# EAGLE design shield (EAGLE 7.7.0)
DRAWING_NUMBER: V001; DRAWN: Mario Blunk / Blunk electronic; PROJECT: agile HW demo; STATUS: development

## Sheet 1 of 4: connector core
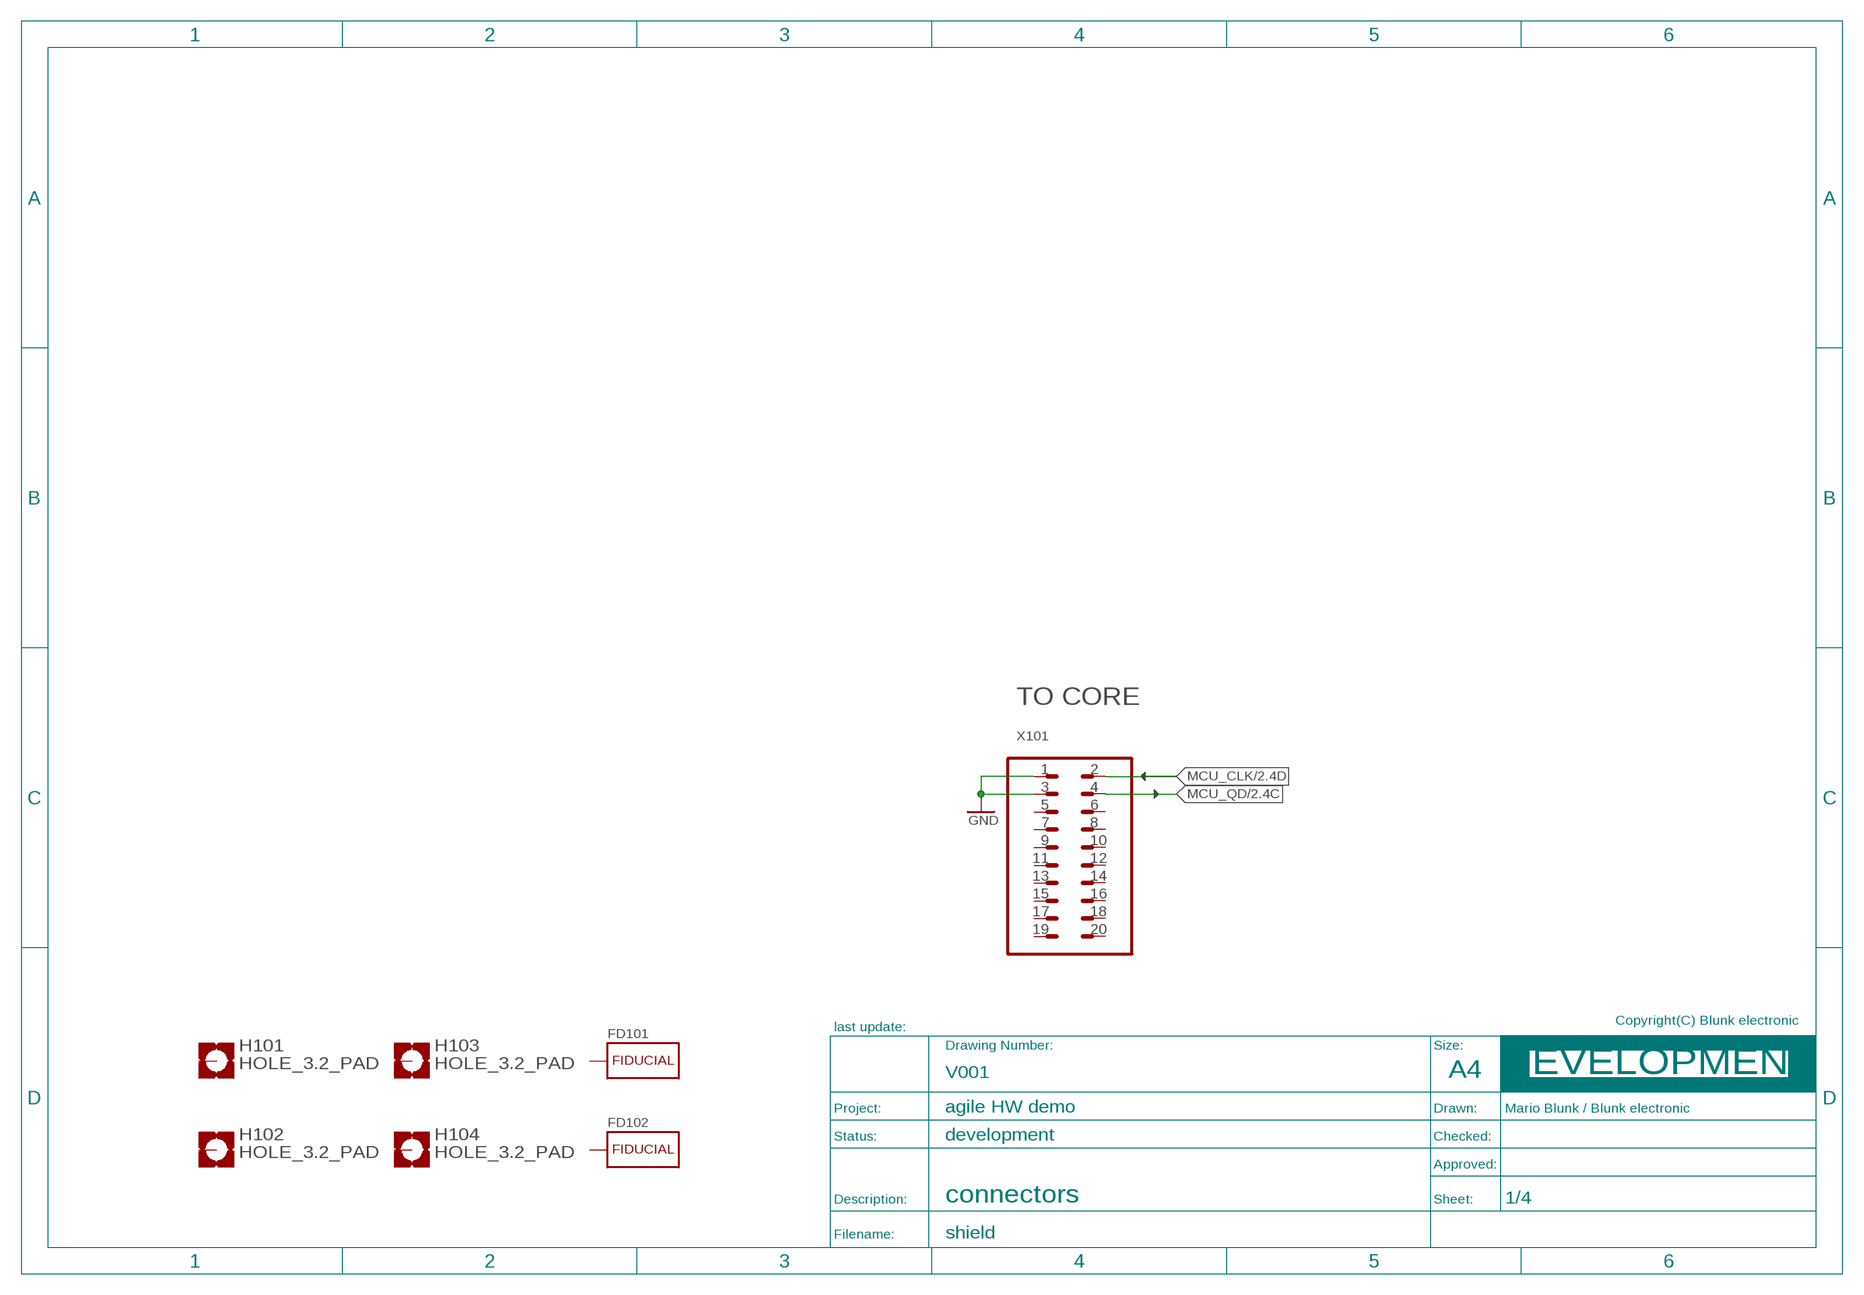
[diagram p0: schematic, sheet 1]
FRAME_DEVELOPMENT1 (A4_LANDSCAPE_DEVELOPMENT): BOM: NO; COMMISSIONED: 2013-08-30; DESCRIPTION: connectors
U$10 (ARROW_1): BOM: NO; COMMISSIONED: 2013-08-30
U$11 (ARROW_1): BOM: NO; COMMISSIONED: 2013-08-30

### Parts
FD101  FIDUCIAL_CROSSHAIR  [CROSSHAIR]
FD102  FIDUCIAL_CROSSHAIR  [CROSSHAIR]
H101  HOLE_3.2_PAD  [3.2_PAD]
H102  HOLE_3.2_PAD  [3.2_PAD]
H103  HOLE_3.2_PAD  [3.2_PAD]
H104  HOLE_3.2_PAD  [3.2_PAD]
X101  MALE_2X10-T-VERTICAL_2.54MM  [T_MALE_2X10_VERTICAL_GRID_2.54MM]

### Nets
GND: X101.1 X101.3 ; also sheet 3,4
MCU_CLK: X101.2 ; also sheet 2
MCU_QD: X101.4 ; also sheet 2
Unconnected: FD101.1(NC) FD102.1(NC) H101.H1(MOUNT) H102.H1(MOUNT) H103.H1(MOUNT) H104.H1(MOUNT) X101.5 X101.6 X101.7 X101.8 X101.9 X101.10 X101.11 X101.12 X101.13 X101.14 X101.15 X101.16 X101.17 X101.18 X101.19 X101.20

## Sheet 2 of 4: routing
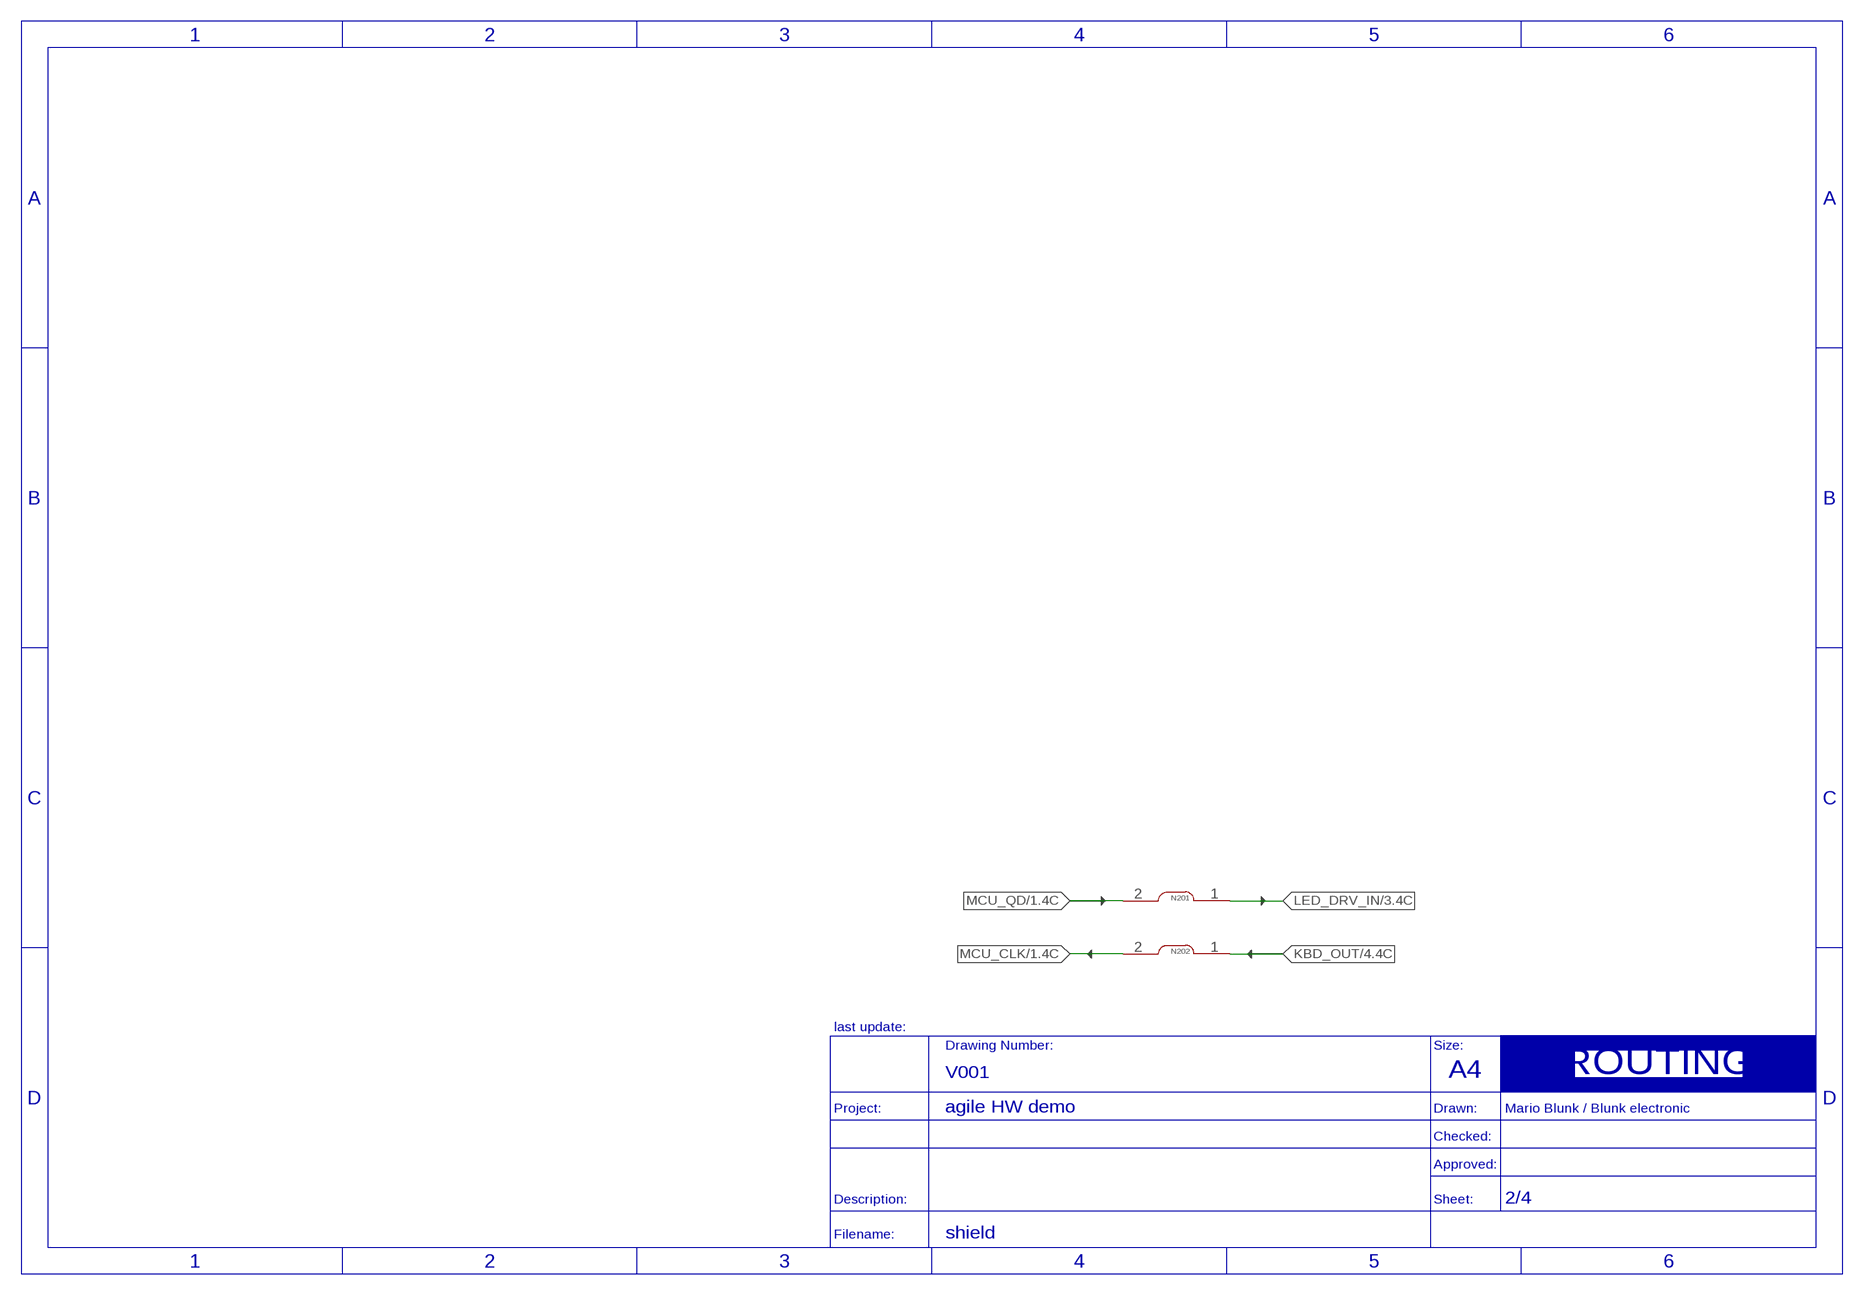
[diagram p1: schematic, sheet 2]
FRAME_NET_CHANGERS1 (A4_LANDSCAPE_NET_CHANGERS): BOM: NO; COMMISSIONED: 2013-08-30
U$2 (ARROW_1): BOM: NO; COMMISSIONED: 2013-08-30
U$3 (ARROW_1): BOM: NO; COMMISSIONED: 2013-08-30
U$4 (ARROW_1): BOM: NO; COMMISSIONED: 2013-08-30
U$5 (ARROW_1): BOM: NO; COMMISSIONED: 2013-08-30

### Parts
N201  NET_CHANGER-S-0.3MM  [S_NET_CHANGER_0.3MM]
N202  NET_CHANGER-S-0.15MM  [S_NET_CHANGER_0.15MM]

### Nets
KBD_OUT: N202.1 ; also sheet 4
LED_DRV_IN: N201.1 ; also sheet 3
MCU_CLK: N202.2 ; also sheet 1
MCU_QD: N201.2 ; also sheet 1

## Sheet 3 of 4: connector LED driver module
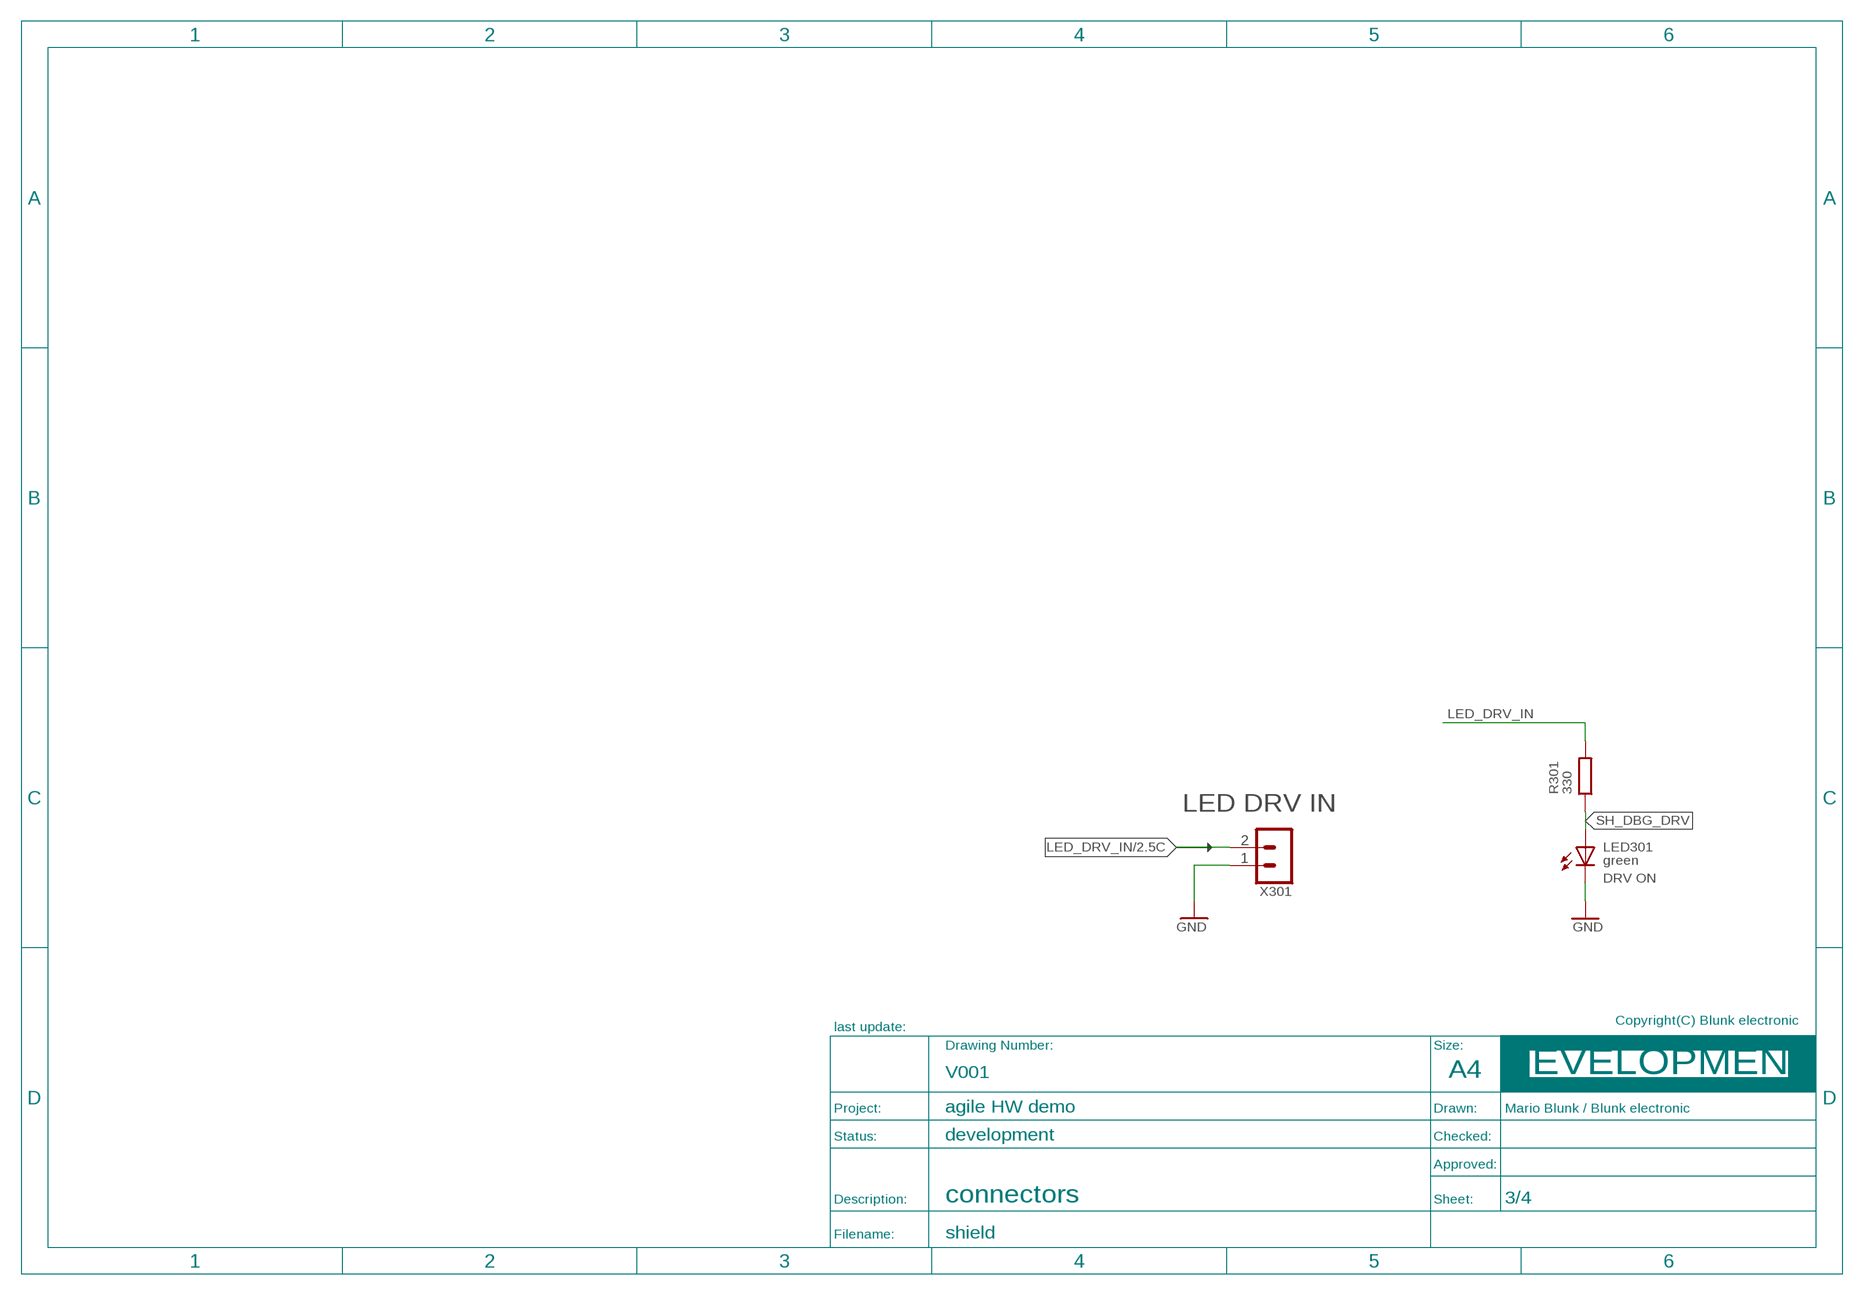
[diagram p2: schematic, sheet 3]
FRAME_DEVELOPMENT2 (A4_LANDSCAPE_DEVELOPMENT): BOM: NO; COMMISSIONED: 2013-08-30; DESCRIPTION: connectors
U$1 (ARROW_1): BOM: NO; COMMISSIONED: 2013-08-30

### Parts
LED301  green  LED_S_0805  [S_0805]
R301  330  R_S_0805  [S_0805]
X301  MALE_2X1-T-VERTICAL  [T_MALE_2X1_VERTICAL_PITCH_2MM54]

### Nets
GND: LED301.C X301.1 ; also sheet 1,4
LED_DRV_IN: R301.2 X301.2 ; also sheet 2
SH_DBG_DRV: LED301.A R301.1

## Sheet 4 of 4: connector keyboard module
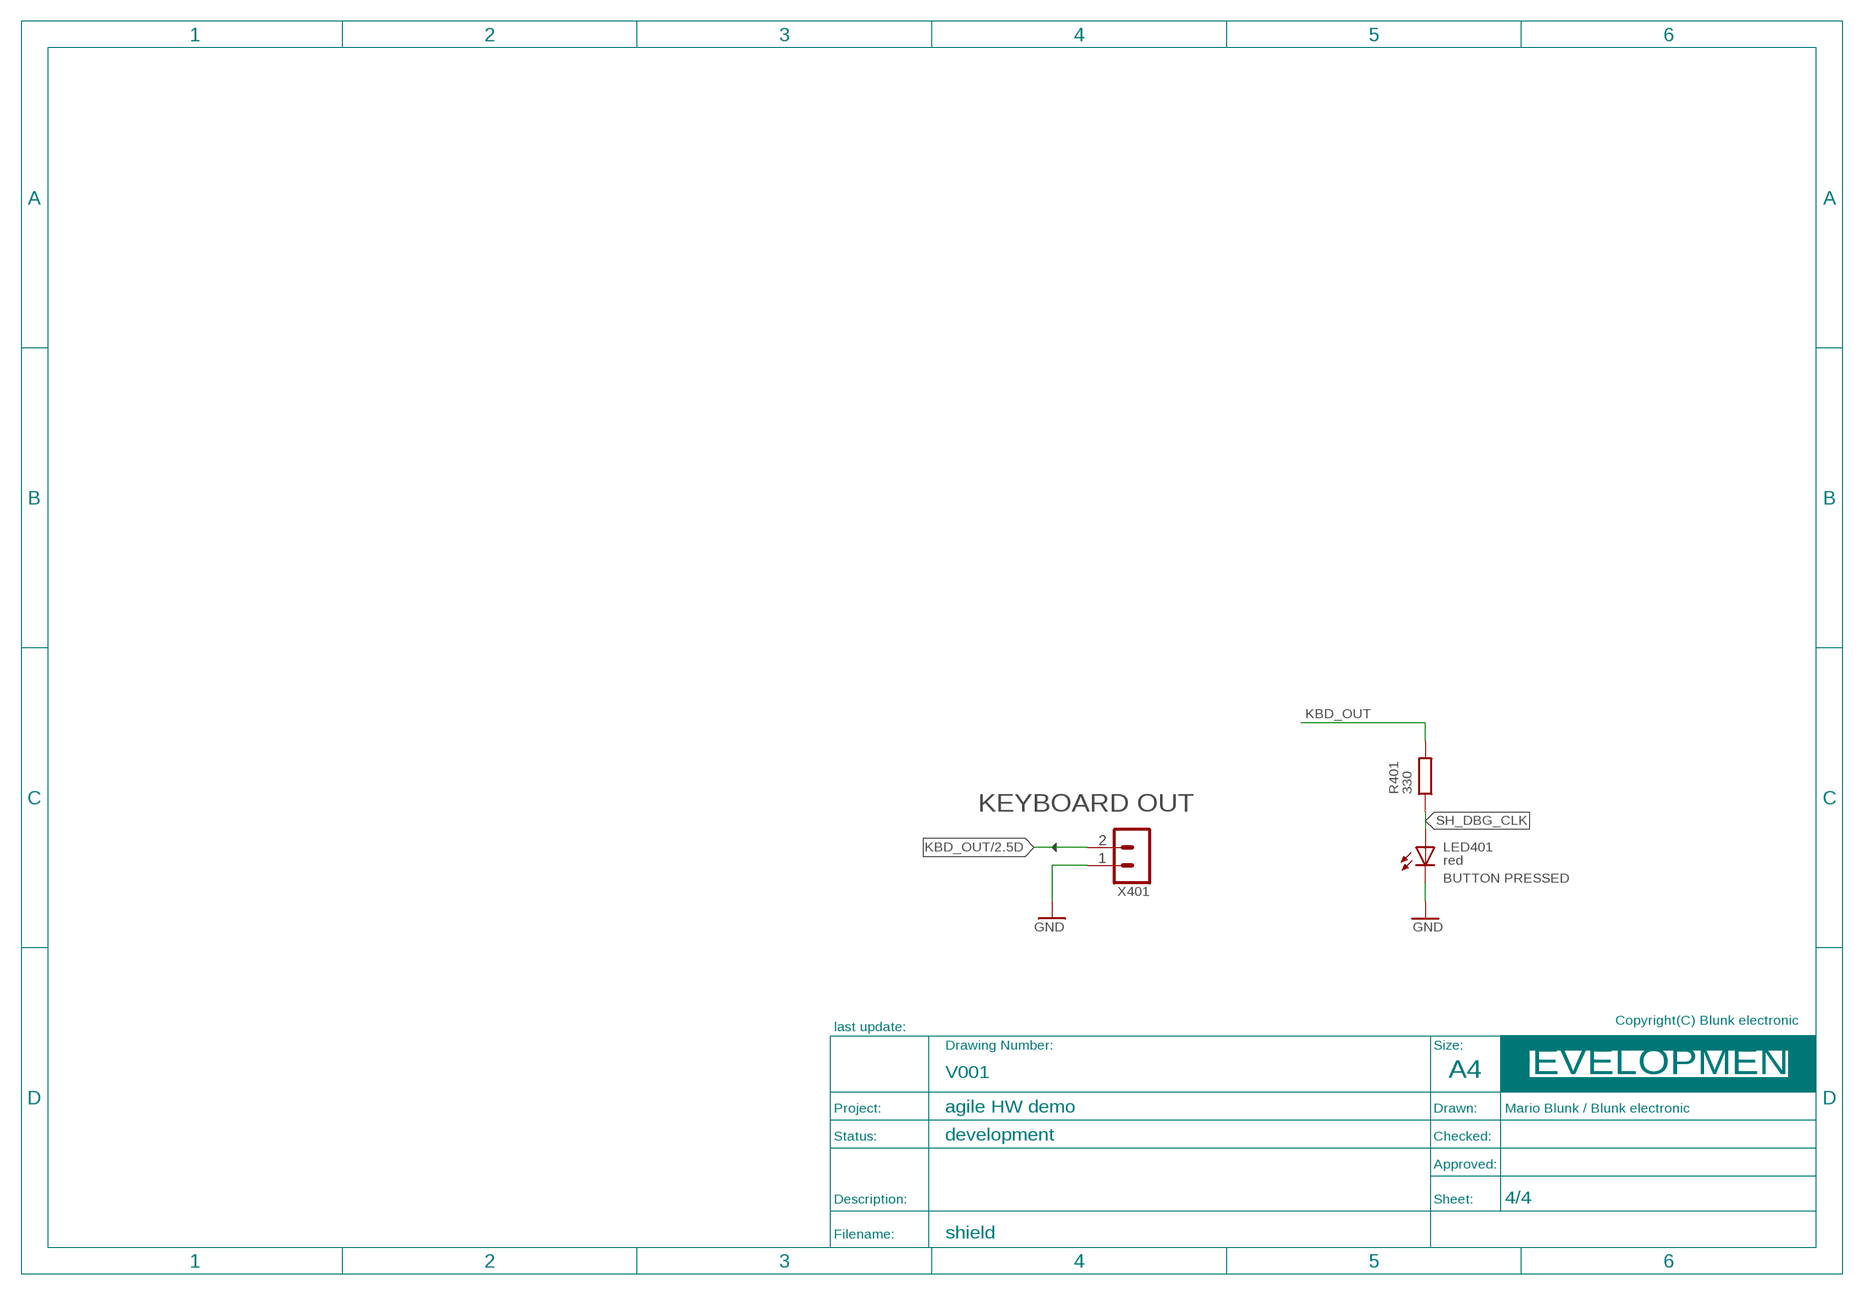
[diagram p3: schematic, sheet 4]
FRAME_DEVELOPMENT3 (A4_LANDSCAPE_DEVELOPMENT): BOM: NO; COMMISSIONED: 2013-08-30
U$6 (ARROW_1): BOM: NO; COMMISSIONED: 2013-08-30

### Parts
LED401  red  LED_S_0805  [S_0805]
R401  330  R_S_0805  [S_0805]
X401  MALE_2X1-T-VERTICAL  [T_MALE_2X1_VERTICAL_PITCH_2MM54]

### Nets
GND: LED401.C X401.1 ; also sheet 1,3
KBD_OUT: R401.2 X401.2 ; also sheet 2
SH_DBG_CLK: LED401.A R401.1

## Library data of the parts
FD101 FD102 = be_marks:FIDUCIAL: drawn: Mario Blunk / Blunk electronic; BOM: NO; COMMISSIONED: 2013-12-03
H101-H104 = be_holes:HOLE: edited: Mario Blunk; BOM: NO; COMMISSIONED: 2015-01-15
LED301 = be_opt:LED: single LED device drawn: Mario Blunk / Blunk electronic; BOM: YES; COMMISSIONED: 2013-08-30; FUNCTION: DRV ON; PART_CODE_BEL: LED_PAC_S_0805_VAL_green
LED401 = be_opt:LED: single LED device drawn: Mario Blunk / Blunk electronic; BOM: YES; COMMISSIONED: 2013-08-30; FUNCTION: BUTTON PRESSED; PART_CODE_BEL: LED_PAC_S_0805_VAL_red
N201 = be_con_jump:NET_CHANGER: drawn: Mario Blunk / Blunk electronic; BOM: NO; COMMISSIONED: 2014-04-09; PART_CODE_BEL: N_PAC_S_NET_CHANGER_0.3MM
N202 = be_con_jump:NET_CHANGER: drawn: Mario Blunk / Blunk electronic; BOM: NO; COMMISSIONED: 2013-08-30; PART_CODE_BEL: N_PAC_S_NET_CHANGER_0.15MM
R301 R401 = be_rcl:R: edited: Mario Blunk / Blunk electronic; BOM: YES; COMMISSIONED: 2013-08-30; PART_CODE_BEL: R_PAC_S_0805_VAL_330
X101 = be_con_jump:MALE_2X10: drawn: Mario Blunk / Blunk electronic; BOM: YES; COMMISSIONED: 2013-08-30; FUNCTION: TO CORE; PART_CODE_BEL: X_PAC_T_MALE_2X10_VERTICAL_PITCH_2mm54
X301 = be_con_jump:MALE_2X1: edited: Mario Blunk / Blunk electronic; BOM: YES; COMMISSIONED: 2013-08-30; FUNCTION: LED DRV IN; PART_CODE_BEL: X_PAC_T_MALE_2X1_VERTICAL_PITCH_2mm54; UPDATED: 2018-08-01
X401 = be_con_jump:MALE_2X1: edited: Mario Blunk / Blunk electronic; BOM: YES; COMMISSIONED: 2013-08-30; FUNCTION: KEYBOARD OUT; PART_CODE_BEL: X_PAC_T_MALE_2X1_VERTICAL_PITCH_2mm54; UPDATED: 2018-08-01

## Board
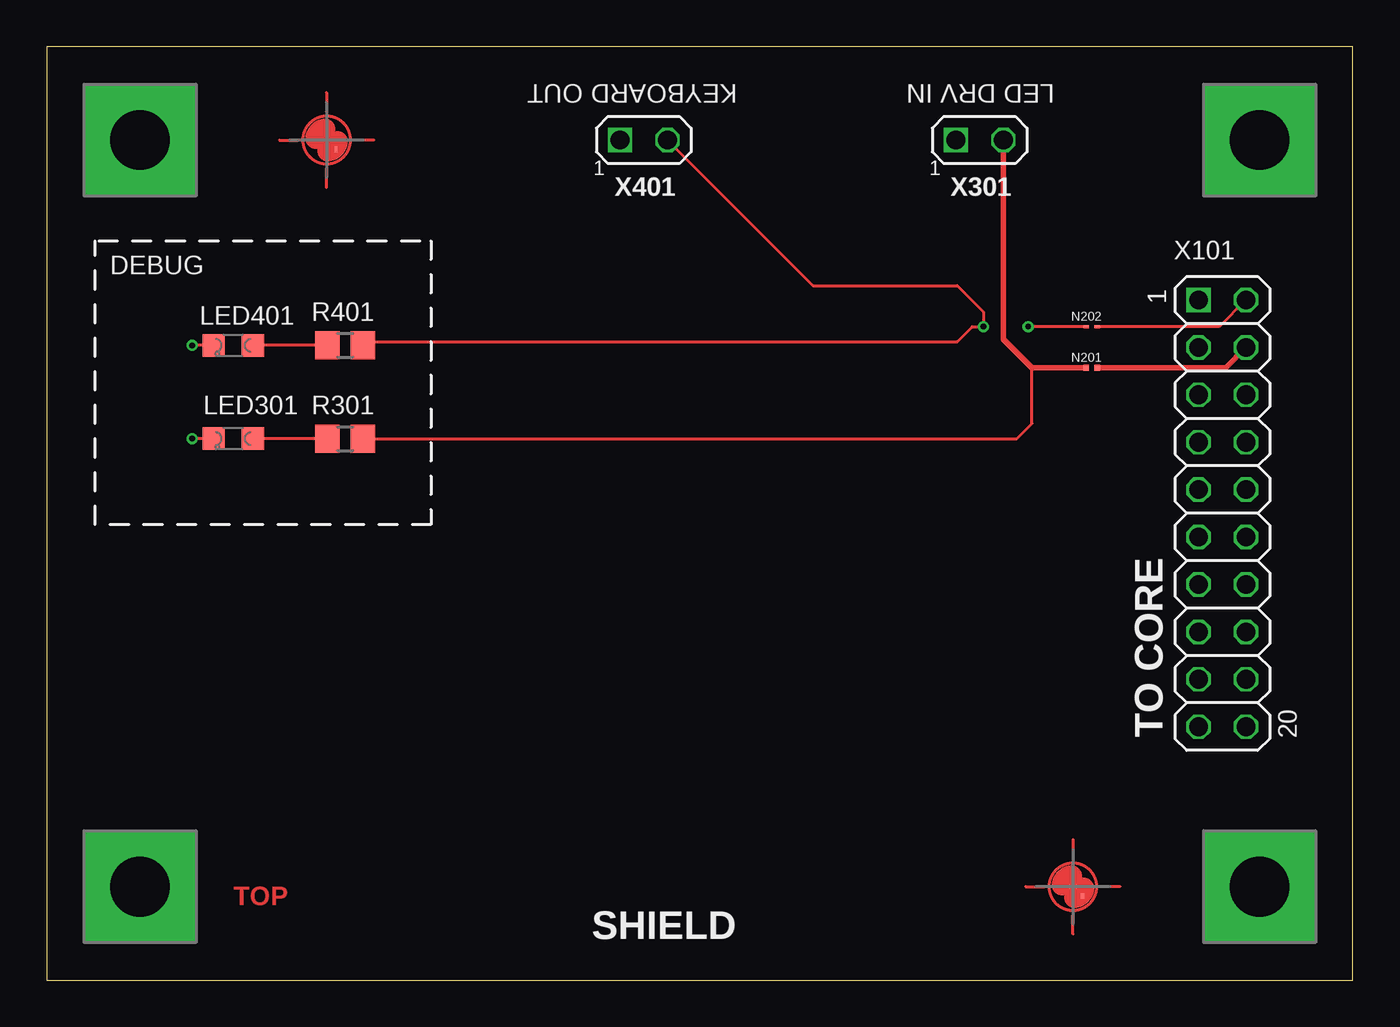
[diagram p4: board, top side]
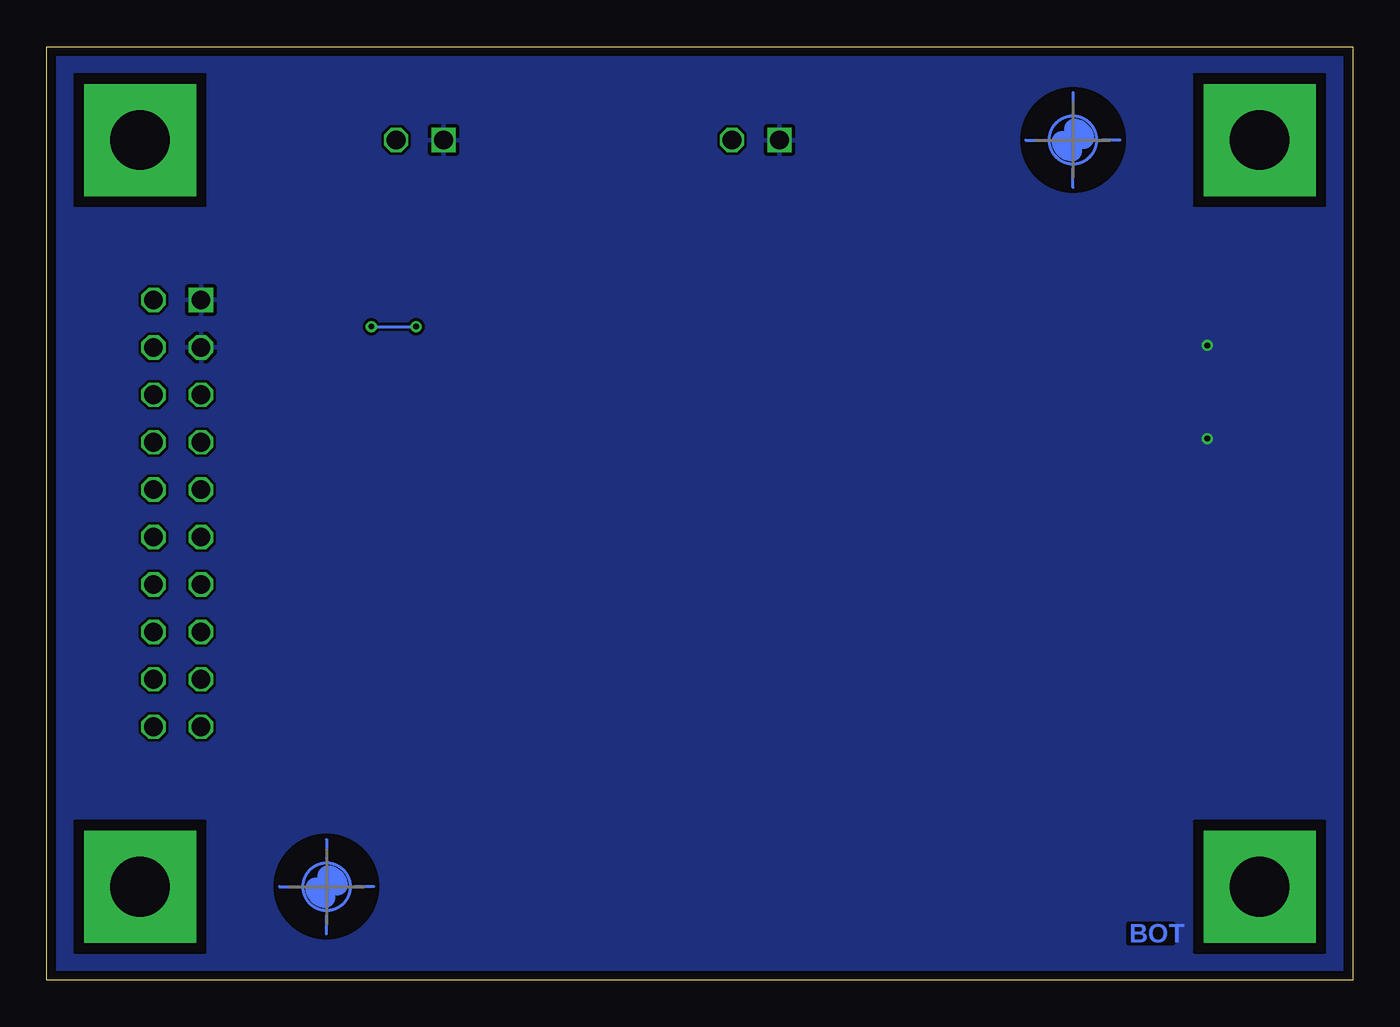
[diagram p5: board, bottom side, seen from below]

Size 70 x 50 mm. Coordinates in mm from the lower left corner, seen from the top.
Outline: 0,0 70,0 70,50 0,50 0,0
Copper layers (1+2*15+16): Top 0.018mm / dielectric 0.37mm / Route2 0.035mm / dielectric 0.65mm / Route15 0.035mm / dielectric 0.37mm / Bottom 0.018mm
Design rules "JLP_ML4_std": minimum track width 0.15mm, minimum drill 0.3mm, track to track 0.15mm, track to pad 0.15mm, pad to pad 0.15mm, via to via 0.15mm, smd to smd 0.15mm, copper to edge 0.5mm, drill to drill 0.2mm, minimum pad ring 0.15mm, minimum via ring 0.15mm, stop-mask expansion 0.075mm, vias tented up to drill 0.3mm, thermal gap 0.2mm

### Footprints (pad centres in the part's own frame; a part is rotated, then mirrored left to right if it is on the bottom)
CROSSHAIR = smd 0.305 x 0.152: 1 0.5,0.5
3.2_PAD = drill 3.2 pad 6 square: H1 0,0
S_0805 = smd 1.2 x 1.2: A 0,-1.05; C 0,1.05
S_NET_CHANGER_0.3MM = smd 0.3 x 0.3: 1 -0.3,0; 2 0.3,0
S_NET_CHANGER_0.15MM = smd 0.3 x 0.15: 1 -0.3,0; 2 0.3,0
S_0805' = smd 1.3 x 1.5: 1 -0.95,0; 2 0.95,0
T_MALE_2X10_VERTICAL_GRID_2.54MM = drill 1 square: 1 -11.43,-1.27 | drill 1 octagon: 2 -11.43,1.27; 3 -8.89,-1.27; 4 -8.89,1.27; 5 -6.35,-1.27; 6 -6.35,1.27; 7 -3.81,-1.27; 8 -3.81,1.27; 9 -1.27,-1.27; 10 -1.27,1.27; 11 1.27,-1.27; 12 1.27,1.27; 13 3.81,-1.27; 14 3.81,1.27; 15 6.35,-1.27; 16 6.35,1.27; 17 8.89,-1.27; 18 8.89,1.27; 19 11.43,-1.27; 20 11.43,1.27
T_MALE_2X1_VERTICAL_PITCH_2MM54 = drill 1 square: 1 0,-1.27 | drill 1 octagon: 2 0,1.27

### Placement (x,y rotation side)
FD101  15,45 270 top
FD102  55,5 270 top
H101  5,45 270 top
H102  65,5 270 top
H103  65,45 270 top
H104  5,5 270 top
LED301  10,29 90 top
LED401  10,34 90 top
N201  56,32.8 0 top
N202  56,35 0 top
R301  330  [S_0805']  16,29 0 top
R401  330  [S_0805']  16,34 0 top
U$9  [A4_LANDSCAPE]  -158.4,-57 0 top  (outside the outline)
X101  63,25 270 top
X301  50,45 270 top
X401  32,45 270 top

### Tracks (layer width: path | path; a pad name or v marks a point on that pad's centre or on a via)
GND  (via drill 0.3)
  Top 0.15: LED301.C v7.8,29 | LED401.C v7.8,34
  pour Bottom: 0,50 70,50 70,0 0,0
  pour Bottom: 0,50 70,50 70,0 0,0
KBD_OUT  (via drill 0.3)
  Top 0.15: N202.1 v52.6,35 | R401.2 17.15,34.2 48.8,34.2 49.6,35 v50.2,35 50.2,35.8 48.8,37.2 41.07,37.2 X401.2
  Bottom 0.15: v52.6,35 v50.2,35
LED_DRV_IN
  Top 0.15: R301.2 52,29 52.8,29.8 52.8,32.8
  Top 0.3: N201.1 52.8,32.8 51.27,34.33 X301.2
MCU_CLK
  Top 0.15: X101.2 62.84,35 N202.2
MCU_QD
  Top 0.3: X101.4 63.18,32.8 N201.2
SH_DBG_CLK
  Top 0.15: R401.1 LED401.A
SH_DBG_DRV
  Top 0.15: R301.1 LED301.A

### Text on the board
Top: TOP
Bottom: BOT
tPlace: DEBUG | SHIELD